# EasyEDA Pro project wireless charger controller.eprj, board PCB1
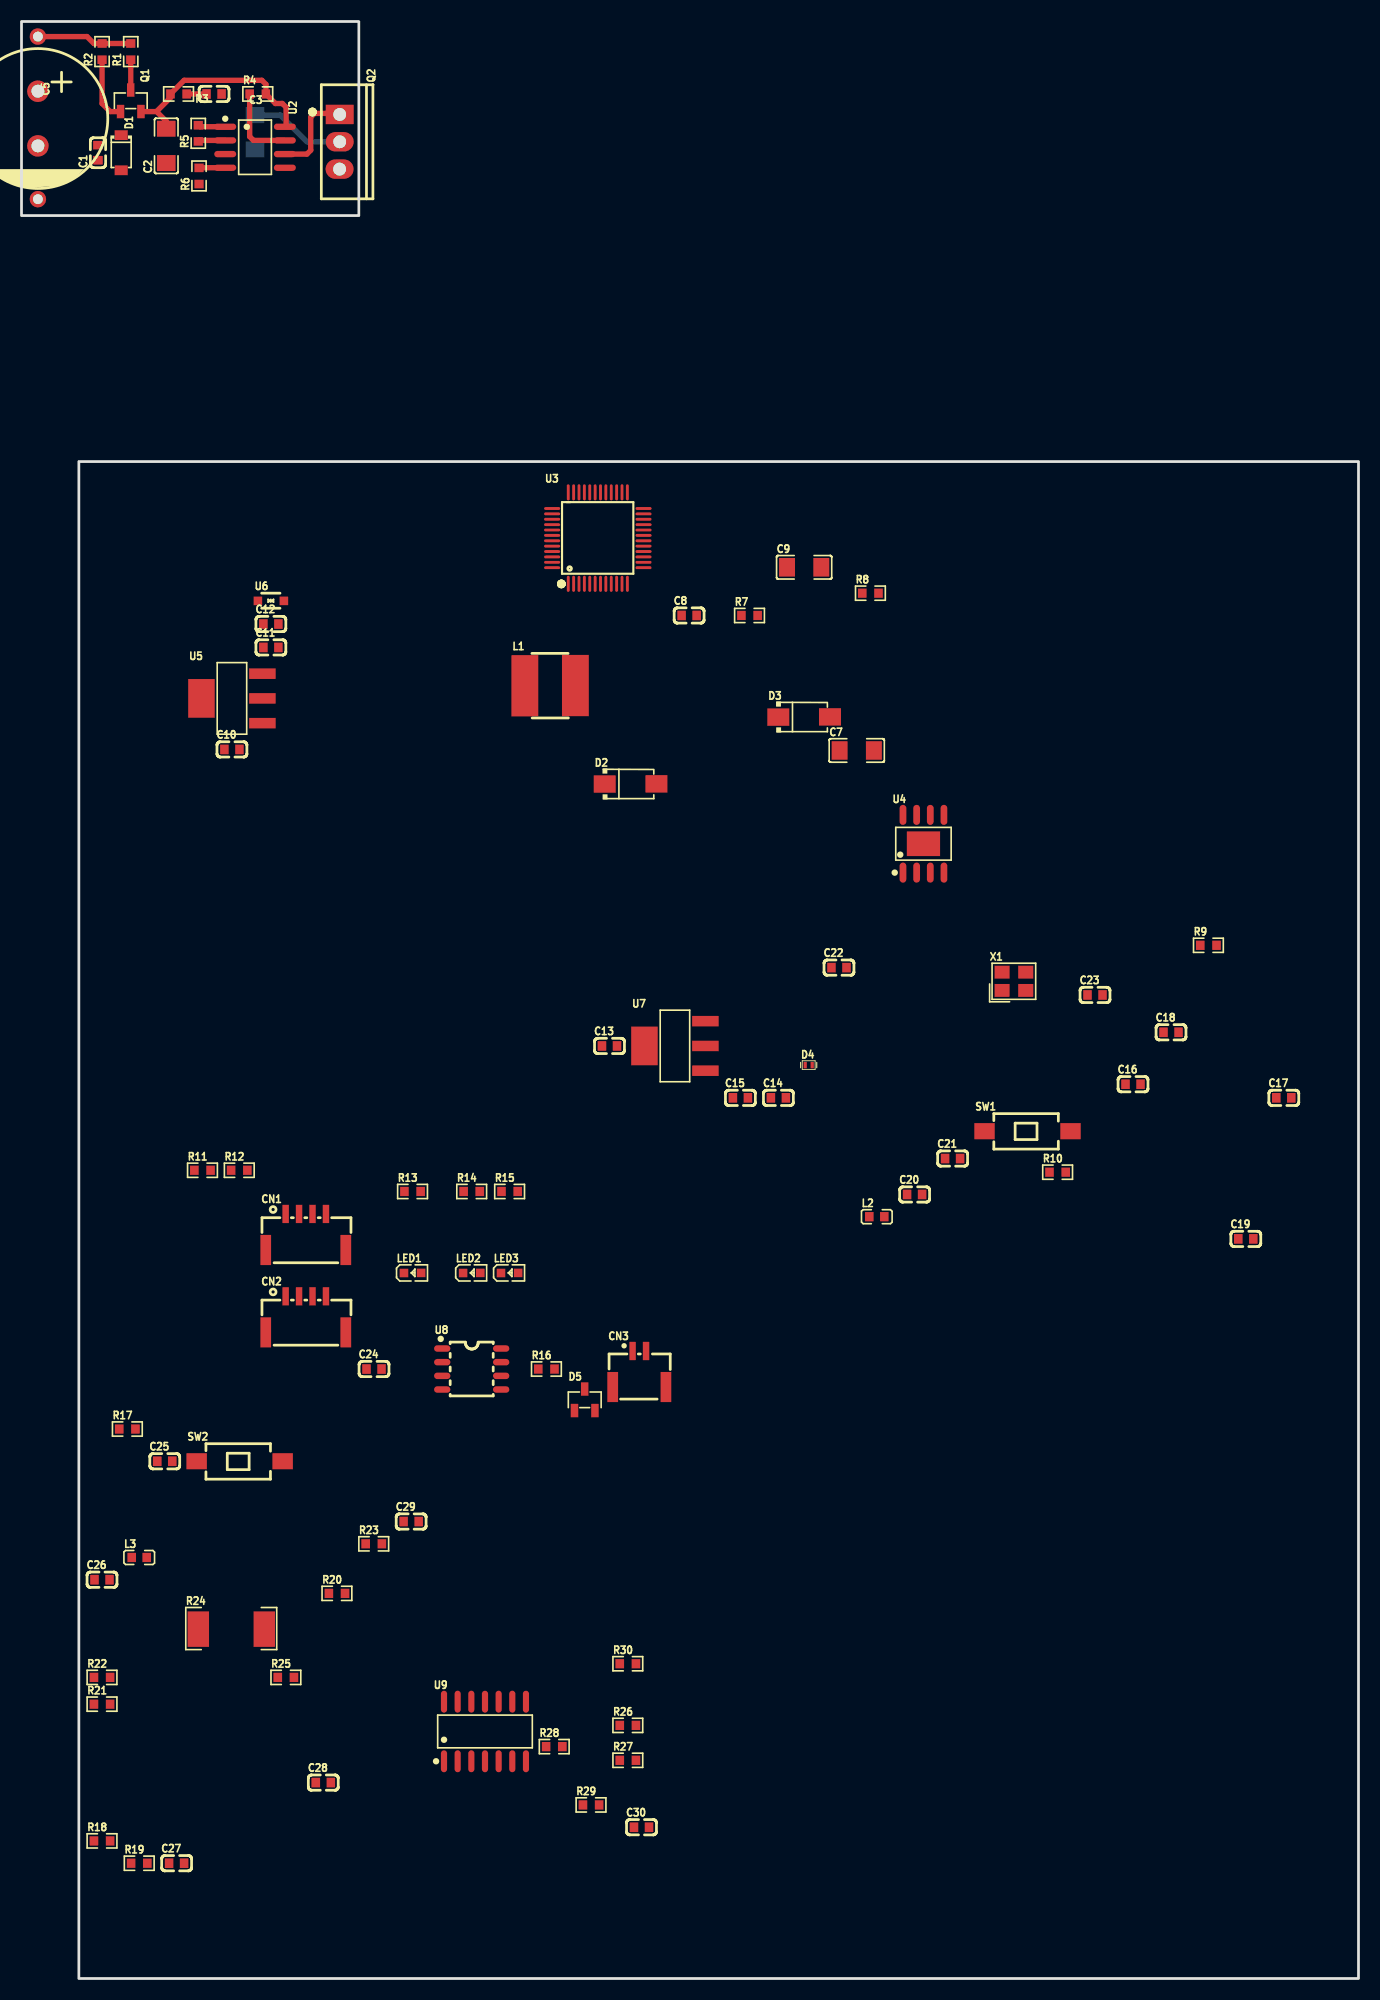
[diagram p4: board, top side]
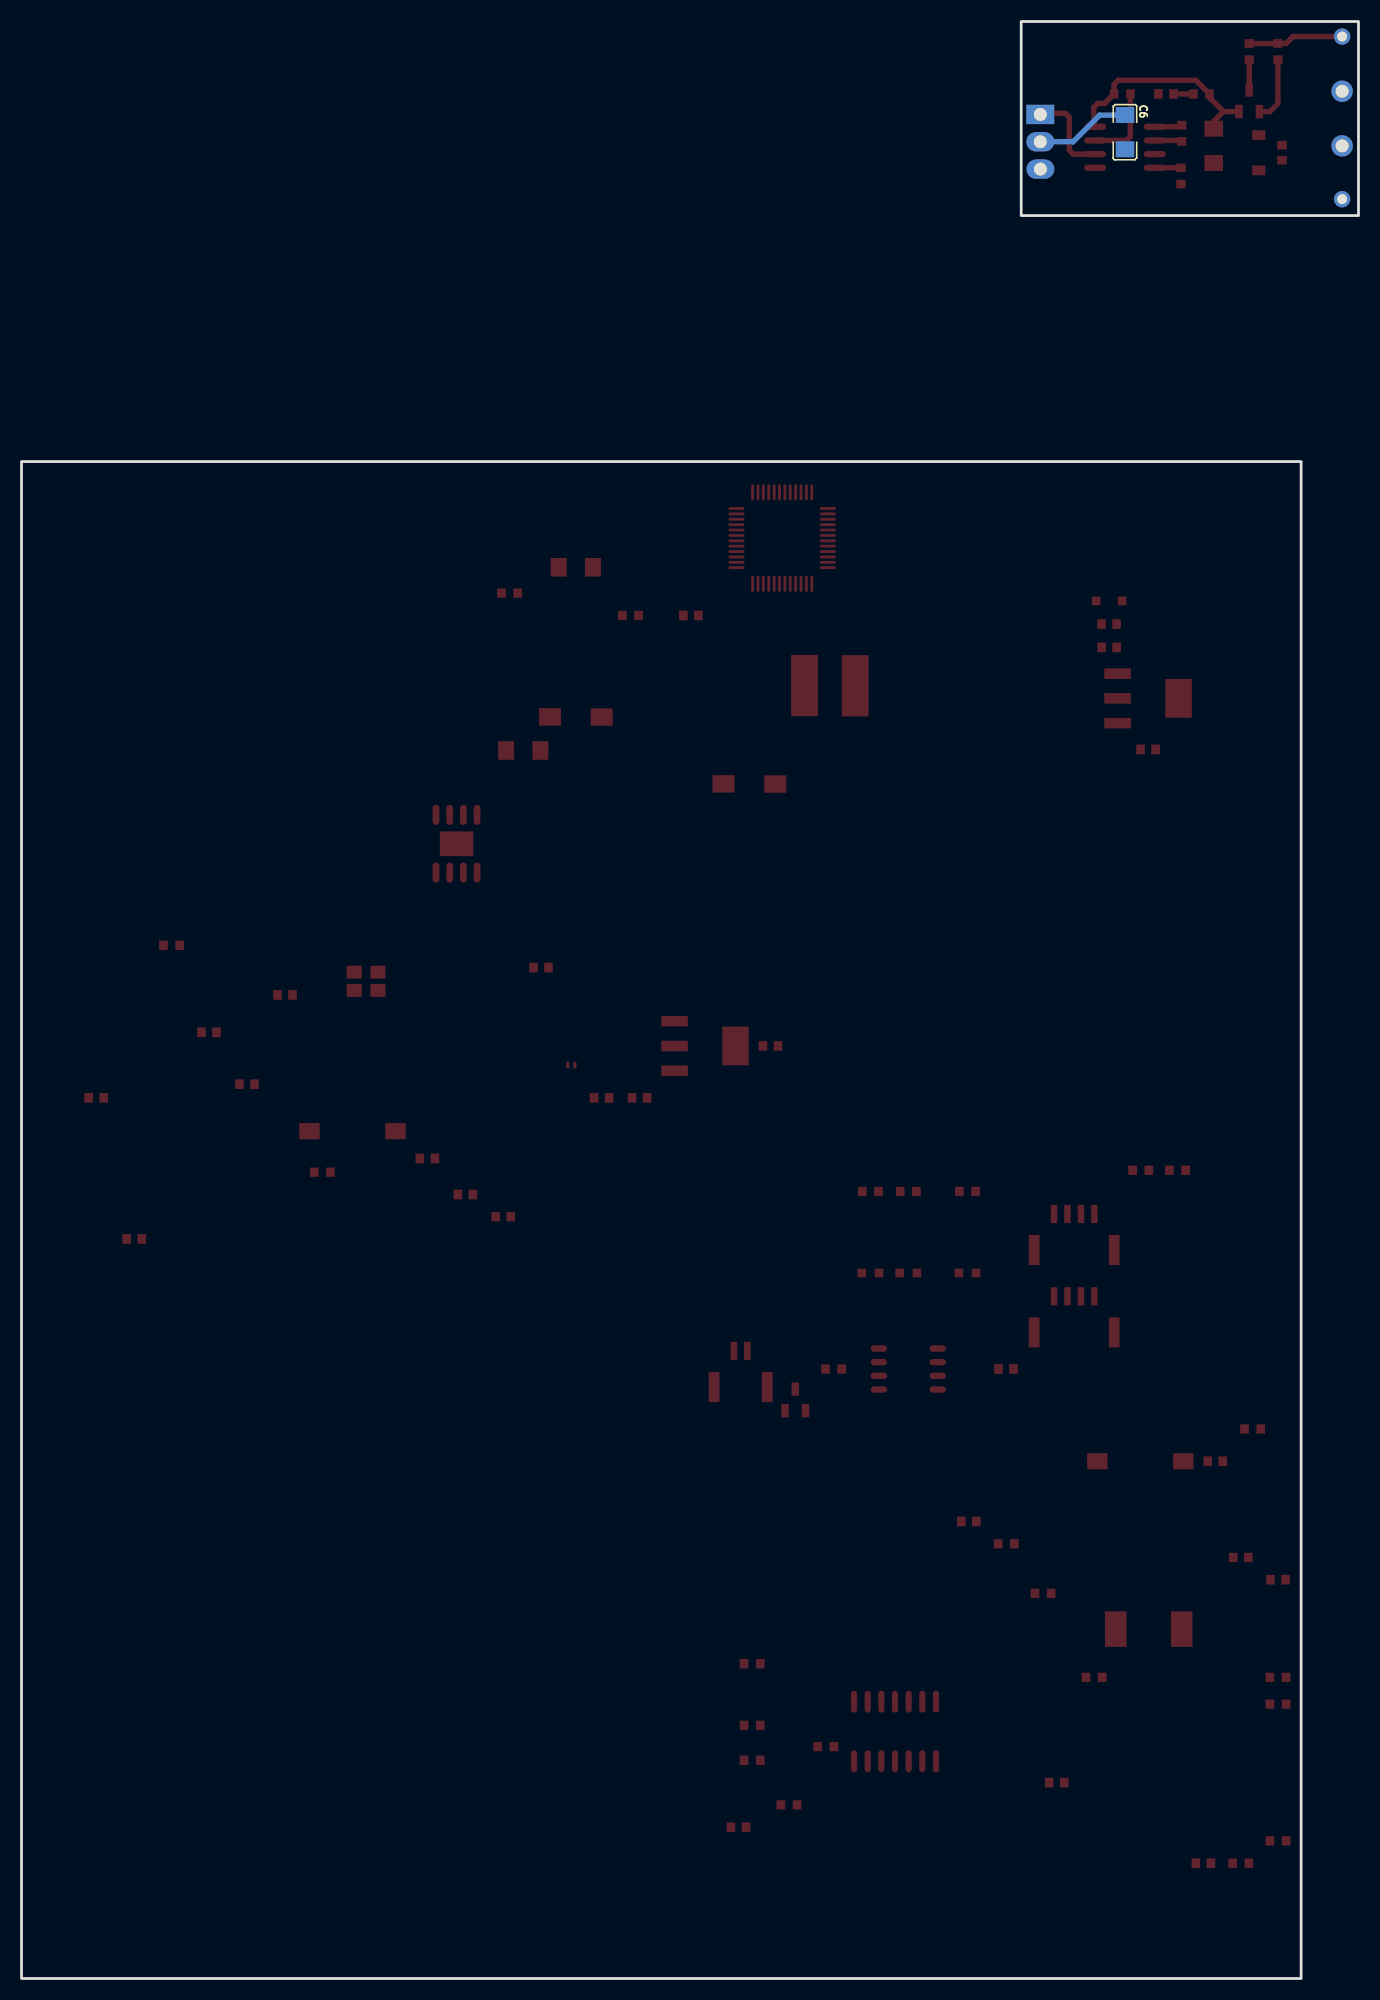
[diagram p5: board, bottom side, seen from below]

Outline 124.33 x 181.86 mm; copper layers: Top Layer, Bottom Layer. Coordinates in mm from the lower left corner of the outline.
Outline path: rectangle 0,181.86 31.37,163.83 ; rectangle 5.33,140.97 124.33,0
Stack: Top Layer 0.035mm / Dielectric1 1.51mm FR4 er 4.5 / Bottom Layer 0.035mm

## Design rules (mm)
template: JLCPCB Capability(Two Layers Board)
spacing copperThickness1oz (default): track to track 0.102, other pairs 0.152 to 0.3
spacing copperThickness2oz: track to track 0.203, other pairs 0.152 to 0.3
track width copperThickness1oz (default): min 0.127, default 0.254, max 2.54
track width copperThickness2oz: min 0.203, default 0.254, max 2.54
differential pair differentialPair (default): width min 0.127, default 0.254, max 2.54; gap min 0.152, default 0.152
via viaSize (default): diameter min 0.5, default 0.61, max 10; hole min 0.3, default 0.305, max 6.3

## Placement (name value [footprint] x y rotation side)
C1  100nF  [C0603]  7.11 169.67 90 top
C2  47uF  [C1206]  13.46 170.31 90 top
C3  1nF  [C0603]  17.91 175.13 180 top
C5  1000uF  [CAP-TH_BD13.0-P5.00-D1.2-FD]  1.52 172.85 270 top
C6  100nF  [C1206]  21.72 171.58 270 bottom
C7  10uF  [C1206]  77.67 114.12 0 top
C8  33nF  [C0603]  62.08 126.67 0 top
C9  47uF  [C1206]  72.78 131.15 0 top
C10  100nF  [C0603]  19.57 114.22 0 top
C11  10uF  [C0603]  23.19 123.7 0 top
C12  100nF  [C0603]  23.19 125.87 0 top
C13  100nF  [C0603]  54.68 86.66 0 top
C14  10uF  [C0603]  70.39 81.84 0 top
C15  100nF  [C0603]  66.85 81.84 0 top
C16  100nF  [C0603]  103.36 83.11 0 top
C17  100nF  [C0603]  117.39 81.84 0 top
C18  100nF  [C0603]  106.9 87.93 0 top
C19  100nF  [C0603]  113.85 68.73 0 top
C20  100nF  [C0603]  83.06 72.86 0 top
C21  100nF  [C0603]  86.59 76.2 0 top
C22  22pF  [C0603]  76.02 93.94 0 top
C23  22pF  [C0603]  99.83 91.4 0 top
C24  100nF  [C0603]  32.78 56.64 0 top
C25  100nF  [C0603]  13.32 48.07 0 top
C26  100nF  [C0603]  7.49 37.06 0 top
C27  100nF  [C0603]  14.43 10.71 0 top
C28  100nF  [C0603]  28.06 18.2 0 top
C29  10nF  [C0603]  36.23 42.47 0 top
C30  10nF  [C0603]  57.66 14.06 0 top
CN1  ZX-BX-GH1.25-LT4  [CONN-SMD_ZX-BX-GH1.25-LT4]  26.44 69.37 0 top
CN2  ZX-BX-GH1.25-LT4  [CONN-SMD_ZX-BX-GH1.25-LT4]  26.44 61.72 0 top
CN3  WAFER-GH1.25-2PLB  [CONN-TH_2P-P1.25_XUNPU_WAFER-GH1.25-2PLB]  57.45 56.64 0 top
D1  MMSZ5242B  [SOD-123_L2.7-W1.6-LS3.7-RD]  9.27 169.67 270 top
D2  SS510  [SMA_L4.3-W2.6-LS5.0-RD]  56.64 111.01 0 top
D3  SS510  [SMA_L4.3-W2.6-LS5.0-RD]  72.78 117.23 0 top
D4  H5VL10B  [SOD-882_L1.0-W0.6-BI]  73.2 84.89 0 top
D5  NUP2105LT1G  [SOT-23-3_L2.9-W1.3-P1.90-LS2.4-BL-2]  52.38 53.78 0 top
L1  100uH  [IND-SMD_L6.0-W6.0_FNR60XXS]  49.16 120.14 0 top
L2  10uH  [L0603]  79.54 70.79 0 top
L3  10uH  [L0603]  10.95 39.12 0 top
LED1  NCD0603R1  [LED0603-RD_RED]  36.36 65.56 0 top
LED2  NCD0603R1  [LED0603-RD_RED]  41.87 65.56 0 top
LED3  NCD0603R1  [LED0603-RD_RED]  45.39 65.56 0 top
NOREF  -  [Pad_e116]  1.52 180.47 0 top
NOREF#2  -  [Pad_e117]  1.52 165.35 0 top
Q1  MMBT5551  [SOT-23-3_L2.9-W1.3-P1.90-LS2.4-BR]  10.16 174.5 270 top
Q2  -  [IRF9540P_TO-220]  29.59 170.69 270 top
R1  330Ω  [R0603]  10.16 179.07 90 top
R2  100kΩ  [R0603]  7.49 179.07 90 top
R3  47kΩ  [R0603]  14.61 175.13 180 top
R4  47kΩ  [R0603]  21.97 175.13 0 top
R5  3.9kΩ  [R0603]  16.44 171.47 90 top
R6  20kΩ  [R0603]  16.51 167.51 90 top
R7  30kΩ  [R0603]  67.7 126.67 0 top
R8  4.7kΩ  [R0603]  78.94 128.74 0 top
R9  10kΩ  [R0603]  110.38 96.02 0 top
R10  10kΩ  [R0603]  96.35 74.93 0 top
R11  4.7kΩ  [R0603]  16.83 75.11 0 top
R12  4.7kΩ  [R0603]  20.25 75.11 0 top
R13  1kΩ  [R0603]  36.36 73.14 0 top
R14  1kΩ  [R0603]  41.87 73.14 0 top
R15  1kΩ  [R0603]  45.39 73.14 0 top
R16  120Ω  [R0603]  48.81 56.64 0 top
R17  10kΩ  [R0603]  9.84 51.06 0 top
R18  10kΩ  [R0603]  7.49 12.79 0 top
R19  10kΩ  [R0603]  10.95 10.71 0 top
R20  7.5kΩ  [R0603]  29.33 35.79 0 top
R21  1kΩ  [R0603]  7.49 25.5 0 top
R22  1kΩ  [R0603]  7.49 27.98 0 top
R23  1kΩ  [R0603]  32.76 40.39 0 top
R24  10mΩ  [RES-SMD_L6.4-W3.2-R2512]  19.51 32.47 0 top
R25  1kΩ  [R0603]  24.59 27.98 0 top
R26  15kΩ  [R0603]  56.38 23.52 0 top
R27  15kΩ  [R0603]  56.38 20.28 0 top
R28  1kΩ  [R0603]  49.54 21.55 0 top
R29  1kΩ  [R0603]  52.96 16.13 0 top
R30  1kΩ  [R0603]  56.38 29.25 0 top
SW1  TS-1101-C-W  [SW-SMD_L6.0-W3.3-LS8.0]  93.56 78.74 0 top
SW2  TS-1101-C-W  [SW-SMD_L6.0-W3.3-LS8.0]  20.29 48.07 0 top
U2  LM2904DR2G  [SOIC-8_L4.9-W3.9-P1.27-LS6.0-BL]  21.72 170.18 270 top
U3  STM32F334C8T6  [LQFP-48_L7.0-W7.0-P0.50-LS9.0-BL]  53.59 133.86 0 top
U4  XL7005A  [SOIC-8_L4.9-W3.9-P1.27-LS6.0-BL-EP3.1-1]  83.88 105.45 0 top
U5  SPX1117M3-L-3-3/TR  [SOT-223-4_L6.5-W3.5-P2.30-LS7.0-BR]  19.57 118.96 0 top
U6  JED323-3.3V-LC  [SOD-323_L1.7-W1.3-LS2.5-BI]  23.19 128.02 0 top
U7  SPX1117M3-L-5-0/TR  [SOT-223-4_L6.5-W3.5-P2.30-LS7.0-BR]  60.77 86.66 0 top
U8  SN65HVD232D  [SOIC-8_L4.9-W3.9-P1.27-LS6.0-TL]  41.87 56.64 0 top
U9  TLV2374IDR  [SOIC-14_L8.7-W3.9-P1.27-LS6.0-BL]  43.1 22.96 0 top
X1  8MHz  [CRYSTAL-SMD_4P-L3.2-W2.5-BL]  92.29 92.67 0 top

## Footprints (pads in the part's own frame, mm; a bottom-side part is the same pattern mirrored in y, then rotated)
C0603
  rect 0.8x0.9 smd: 1(-0.7,0) 2(0.7,0)
C1206
  rect 1.485x1.728 smd: 1(-1.593,0) 2(1.593,0)
CAP-TH_BD13.0-P5.00-D1.2-FD
  round 2 hole 1.2: 1(-2.54,0) 2(2.54,0)
CONN-SMD_ZX-BX-GH1.25-LT4
  rect 0.6x1.7 smd: 1(-1.875,1.675) 2(-0.625,1.675) 3(0.625,1.675) 4(1.875,1.675)
  rect 1x2.8 smd: 5(3.725,-1.675) 6(-3.725,-1.675)
CONN-TH_2P-P1.25_XUNPU_WAFER-GH1.25-2PLB
  rect 0.6x1.7 smd: 1(-0.625,1.675) 2(0.625,1.675)
  rect 1x2.8 smd: 3(2.475,-1.675) 4(-2.475,-1.675)
CRYSTAL-SMD_4P-L3.2-W2.5-BL
  rect 1.4x1.2 smd: 1(-1.1,-0.85) 2(1.1,-0.85) 3(1.1,0.85) 4(-1.1,0.85)
IND-SMD_L6.0-W6.0_FNR60XXS
  rect 2.5x5.7 smd: 1(-2.35,-0.013) 2(2.35,0.013)
IRF9540P_TO-220
  rect 1.801x2.601 hole 1.199: 1(-2.54,0)
  oval 1.801x2.601 hole 1.199: 2(0,0) 3(2.54,-0.01)
L0603
  rect 0.8x0.864 smd: 1(-0.7,0) 2(0.7,0)
LED0603-RD_RED
  rect 0.8x0.8 smd: 1(-0.799,-0.004) 2(0.799,0.004)
LQFP-48_L7.0-W7.0-P0.50-LS9.0-BL
  oval 0.27x1.5 smd: 1(-2.75,-4.25) 2(-2.25,-4.25) 3(-1.75,-4.25) 4(-1.25,-4.25) 5(-0.75,-4.25) 6(-0.25,-4.25) 7(0.25,-4.25) 8(0.75,-4.25) 9(1.25,-4.25) 10(1.75,-4.25) 11(2.25,-4.25) 12(2.75,-4.25) 25(2.75,4.25) 26(2.25,4.25) 27(1.75,4.25) 28(1.25,4.25) 29(0.75,4.25) 30(0.25,4.25) 31(-0.25,4.25) 32(-0.75,4.25) 33(-1.25,4.25) 34(-1.75,4.25) 35(-2.25,4.25) 36(-2.75,4.25)
  oval 1.5x0.27 smd: 13(4.25,-2.75) 14(4.25,-2.25) 15(4.25,-1.75) 16(4.25,-1.25) 17(4.25,-0.75) 18(4.25,-0.25) 19(4.25,0.25) 20(4.25,0.75) 21(4.25,1.25) 22(4.25,1.75) 23(4.25,2.25) 24(4.25,2.75) 37(-4.25,2.75) 38(-4.25,2.25) 39(-4.25,1.75) 40(-4.25,1.25) 41(-4.25,0.75) 42(-4.25,0.25) 43(-4.25,-0.25) 44(-4.25,-0.75) 45(-4.25,-1.25) 46(-4.25,-1.75) 47(-4.25,-2.25) 48(-4.25,-2.75)
Pad_e116
  round 1.524 hole 0.914: 1(0,0)
Pad_e117
  round 1.524 hole 0.914: 2(0,0)
R0603
  rect 0.806x0.864 smd: 1(-0.753,0) 2(0.753,0)
RES-SMD_L6.4-W3.2-R2512
  rect 2x3.3 smd: 1(-3.067,0) 2(3.067,0)
SMA_L4.3-W2.6-LS5.0-RD
  rect 2.046x1.62 smd: 1(-2.404,-0.009) 2(2.404,0.009)
SOD-123_L2.7-W1.6-LS3.7-RD
  rect 0.91x1.22 smd: 1(-1.635,0) 2(1.635,0)
SOD-323_L1.7-W1.3-LS2.5-BI
  rect 0.8x0.8 smd: 1(-1.205,0) 2(1.205,0)
SOD-882_L1.0-W0.6-BI
  rect 0.3x0.6 smd: 1(-0.325,0) 2(0.325,0)
SOIC-8_L4.9-W3.9-P1.27-LS6.0-BL
  oval 0.588x2.045 smd: 1(-1.905,-2.772) 2(-0.635,-2.772) 3(0.635,-2.772) 4(1.905,-2.772) 5(1.905,2.772) 6(0.635,2.772) 7(-0.635,2.772) 8(-1.905,2.772)
SOIC-8_L4.9-W3.9-P1.27-LS6.0-BL-EP3.1-1
  oval 0.63x1.865 smd: 1(-1.905,-2.683) 2(-0.635,-2.683) 3(0.635,-2.683) 4(1.905,-2.683) 5(1.905,2.683) 6(0.635,2.683) 7(-0.635,2.683) 8(-1.905,2.683)
  rect 3.1x2.3 smd: 9(0,0)
SOIC-8_L4.9-W3.9-P1.27-LS6.0-TL
  oval 1.52x0.6 smd: 1(-2.74,1.905) 2(-2.74,0.635) 3(-2.74,-0.635) 4(-2.74,-1.905) 5(2.74,-1.905) 6(2.74,-0.635) 7(2.74,0.635) 8(2.74,1.905)
SOIC-14_L8.7-W3.9-P1.27-LS6.0-BL
  oval 0.574x2.038 smd: 1(-3.81,-2.769) 2(-2.54,-2.769) 3(-1.27,-2.769) 4(0,-2.769) 5(1.27,-2.769) 6(2.54,-2.769) 7(3.81,-2.769) 8(3.81,2.769) 9(2.54,2.769) 10(1.27,2.769) 11(0,2.769) 12(-1.27,2.769) 13(-2.54,2.769) 14(-3.81,2.769)
SOT-23-3_L2.9-W1.3-P1.90-LS2.4-BL-2
  rect 0.7x1.25 smd: 1(-0.95,-1) 2(0.95,-1) 3(0,1)
SOT-23-3_L2.9-W1.3-P1.90-LS2.4-BR
  rect 1.25x0.7 smd: 1(1,-0.95) 2(1,0.95) 3(-1,0)
SOT-223-4_L6.5-W3.5-P2.30-LS7.0-BR
  rect 2.47x0.98 smd: 1(2.835,-2.3) 2(2.835,0) 3(2.835,2.3)
  rect 2.47x3.6 smd: 4(-2.835,0)
SW-SMD_L6.0-W3.3-LS8.0
  rect 1.9x1.5 smd: 1(-4,0) 2(4,0)

## Nets
As in the schematic, except:
+36V: C5.1 D2.2 NOREF.1 R1.2 R2.2
GND: C1.1 C2.1 C5.2 C7.1 C9.2 C10.2 C11.2 C12.2 C13.2 C14.1 C15.1 C16.2 C17.2 C18.1 C19.2 C20.2 C21.1 C22.2 C23.1 C24.1 C25.1 C26.1 C27.1 C28.1 C29.1 C30.2 CN1.1 CN2.4 D1.2 D3.2 D4.1 D5.3 LED3.1 NOREF#2.2 Q2.3 R6.1 R8.1 R9.2 R19.2 R21.1 R24.2 R30.2 SW1.1 SW2.2 U2.5 U3.8 U3.23 U3.35 U3.47 U4.5 U4.6 U4.7 U4.8 U5.1 U6.2 U7.1 U8.3 U9.11 X1.2 X1.4

Pads without a net: CN1 5 6; CN2 5 6; CN3 3 4; U4 4 9; U8 5 8; U9 12 13 14

## Routing (per net, layer and track width the routed paths; a pad name or vN(x,y) marks a point on that pad's centre or on a via; arc(x,y) is an arc through that point)
+36V: length 9
  Top Layer w0.5: NOREF.1 6.09,180.47 6.73,179.82 R2.2 10.03,179.82 10.16,179.7
$1N453: length 2.8
  Top Layer w0.5: R1.1 Q1.3
$1N1076: length 7.4
  Top Layer w0.5: R4.1 21.22,171.17 21.57,170.81 U2.7
$1N1244: length 2.6
  Top Layer w0.5: U2.1 16.58,172.09 R5.2
$1N1249: length 2.5
  Top Layer w0.5: R5.1 16.53,170.81 U2.2
$1N1263: length 1.8
  Top Layer w0.5: R3.1 C3.2
$1N1418: length 2.4
  Top Layer w0.5: R6.2 16.52,168.28 18.94,168.28
$1N2800: length 8.5
  Top Layer w0.5: Q2.1 29.49,173.33 27.25,173.33 26.9,172.97 26.9,169.9 26.54,169.55 U2.6
$1N2805: length 8.9
  Bottom Layer w0.5: C6.1 24.06,173.17 26.54,170.69 Q2.2
$1N16939: length 6.1
  Top Layer w0.5: Q1.1 8.24,173.5 7.49,174.24 R2.1
$1N16948: length 20.3
  Top Layer w0.5: C2.2 13.46,172.59 12.56,173.5 ; 12.56,173.5 Q1.2 ; 12.56,173.5 13.85,174.79 R3.2 15.12,176.4 22.35,176.4 22.73,176.02 22.73,175.14 R4.2 23.61,174.24 24.26,174.24 24.61,173.89 24.61,172.21 U2.8
